# EAGLE schematic A9G Minimal Hardware (EAGLE 9.6.2)
AUTHOR: Tiago Silva; SOURCE: github.com/TiagoPaulaSilva/A9G-Arduino-Library; VERSION: 1.0
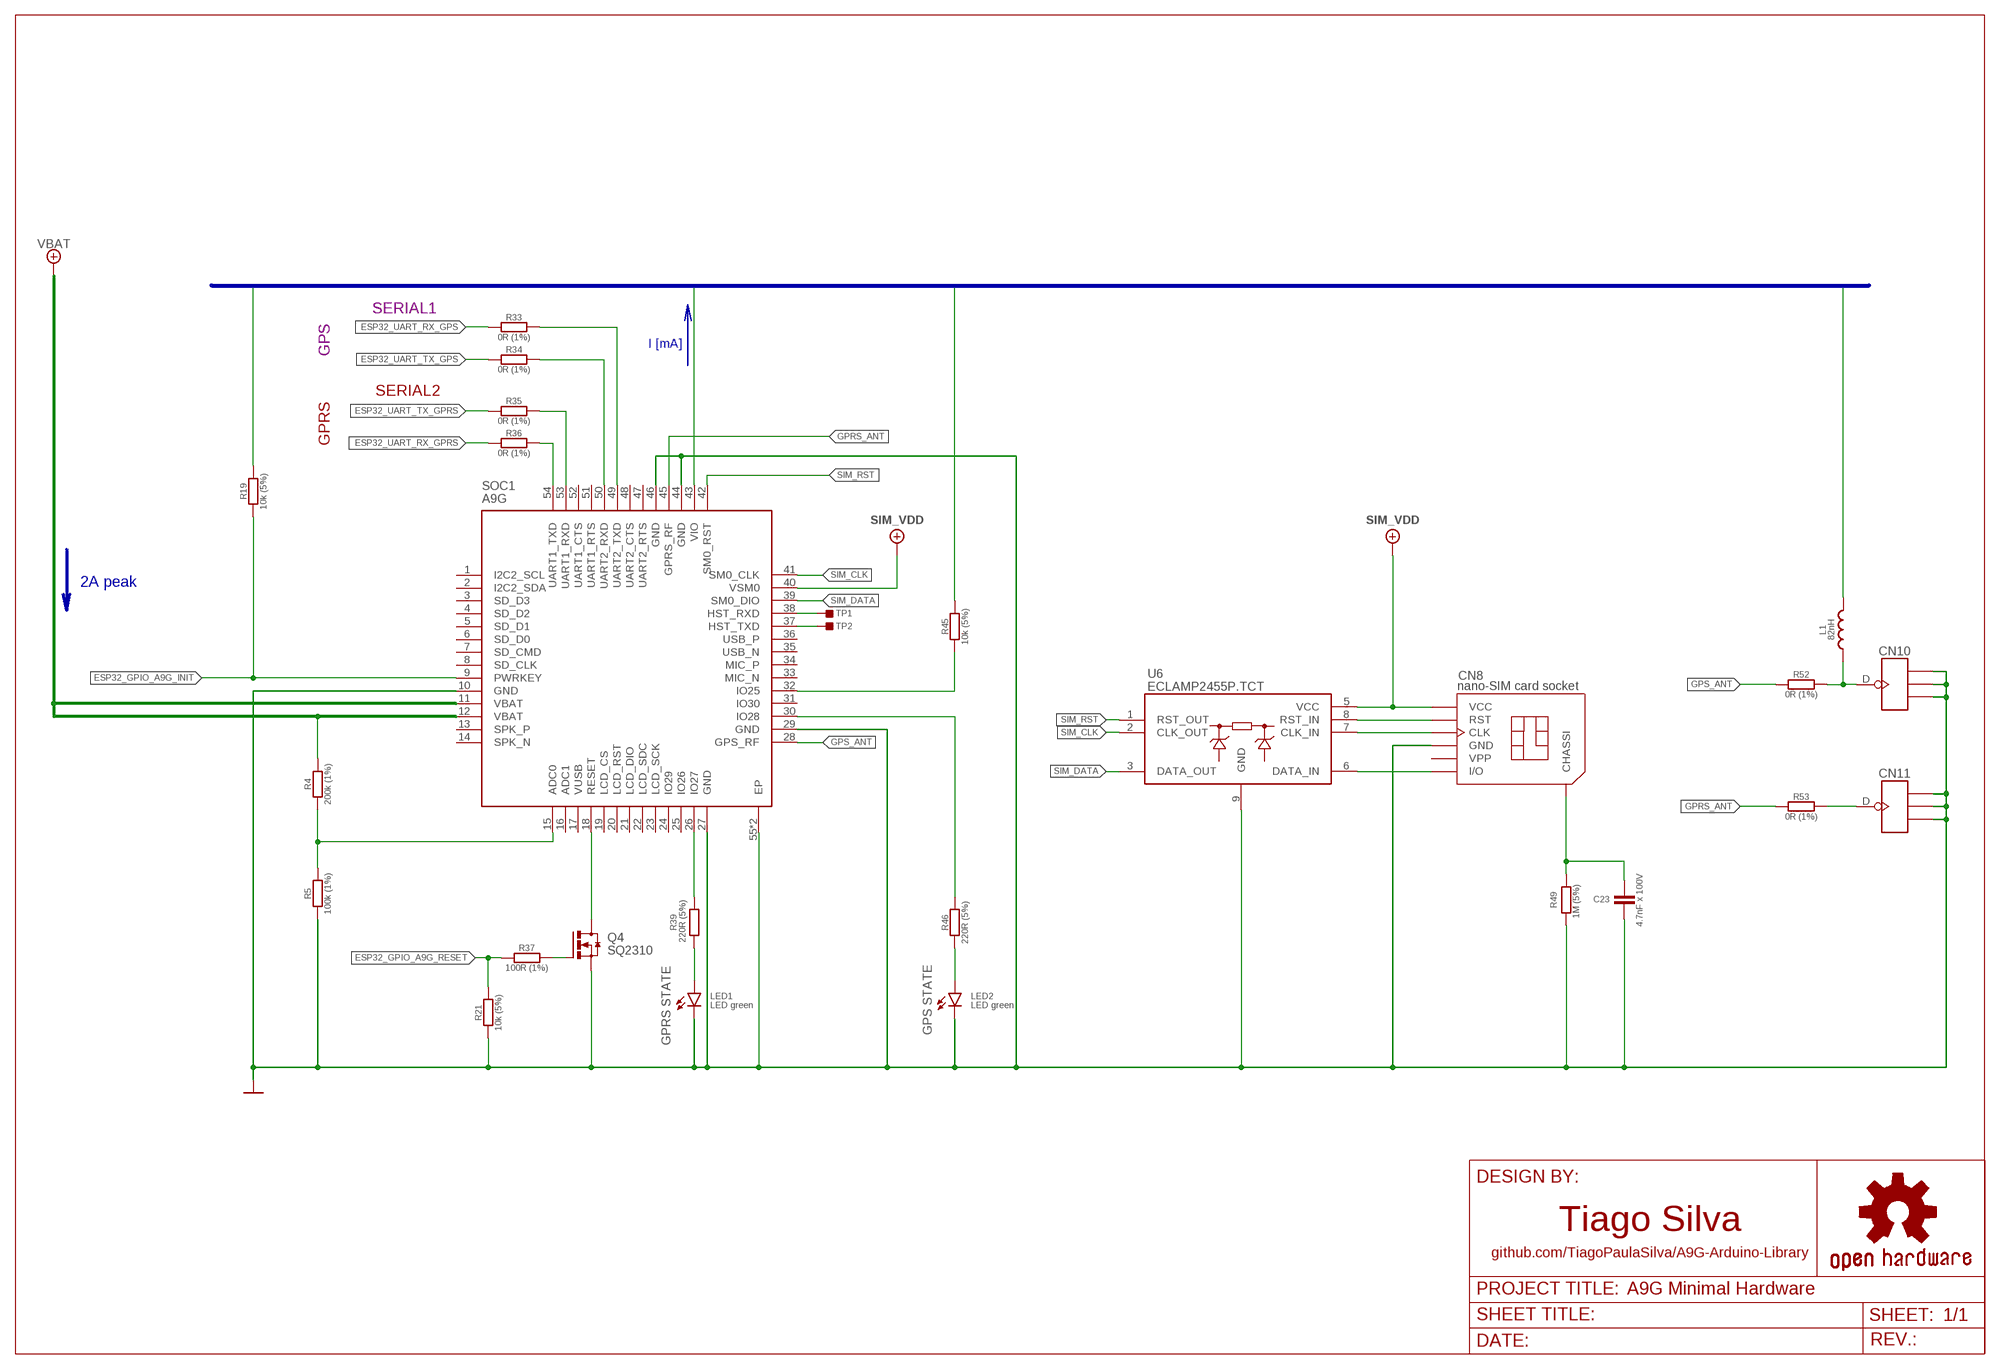
[diagram p0: schematic, sheet 1]

## Parts
C23  4.7nF x 100V  C_0402  [C0402]
CN8  nano-SIM card socket  SIM-CARD  [SIM-CARD]
CN10  ANTENNA-U-FL  [4P-U-FL]
CN11  ANTENNA-U-FL  [4P-U-FL]
L1  82nH  L_0402  [L0402]
LED1  LED green  LED-0603  [LED-0603]
LED2  LED green  LED-0603  [LED-0603]
Q4  N-Channel MOSFET  N-FET-ENHANCEMENT-SQ2310  [SOT23-3]
R4  200k (1%)  R_0402  [R0402]
R5  100k (1%)  R_0402  [R0402]
R19  10k (5%)  R_0402  [R0402]
R21  10k (5%)  R_0402  [R0402]
R33  0R (1%)  R_0402  [R0402]
R34  0R (1%)  R_0402  [R0402]
R35  0R (1%)  R_0402  [R0402]
R36  0R (1%)  R_0402  [R0402]
R37  100R (1%)  R_0402  [R0402]
R39  220R (5%)  R_0402  [R0402]
R45  10k (5%)  R_0402  [R0402]
R46  220R (5%)  R_0402  [R0402]
R49  1M (5%)  R_0402  [R0402]
R52  0R (1%)  R_0402  [R0402]
R53  0R (1%)  R_0402  [R0402]
SOC1  A9G  [A9G]
TP1  ATP2-30  [ATP-30]
TP2  ATP2-30  [ATP-30]
U6  ECLAMP2455P.TCT  [SLP2116P8]

## Nets
0V: C23.1 CN8.C5(GND) CN10.GND1 CN10.GND2 CN10.GND3 CN11.GND1 CN11.GND2 CN11.GND3 LED1.C(K) LED2.C(K) Q4.2(S) R5.1 R21.1 R49.2 SOC1.10(GND) SOC1.27(GND) SOC1.29(GND) SOC1.44(GND) SOC1.46(GND) SOC1.55(EP) SOC1.56(EP) U6.9(GND)
A9G_LOW_POWER: R45.1 SOC1.32(IO25)
ESP32_GPIO_A9G_INIT: R19.1 SOC1.9(PWRKEY)
ESP32_GPIO_A9G_RESET: R21.2 R37.1
ESP32_UART_RX_GPRS: R36.1
ESP32_UART_RX_GPS: R33.1
ESP32_UART_TX_GPRS: R35.1
ESP32_UART_TX_GPS: R34.1
GND_A9G_1: Q4.3(D) SOC1.18(RESET)
GPRS_ANT: R53.1 SOC1.45(GPRS_RF)
GPS_ANT: R52.1 SOC1.28(GPS_RF)
N$1: C23.2 CN8.P1(CHASSI) CN8.P2(CHASSI) CN8.P3(CHASSI) CN8.P4(CHASSI) CN8.P5(CHASSI) CN8.P6(CHASSI) R49.1
N$4: SOC1.38(HST_RXD) TP1.P
N$7: SOC1.37(HST_TXD) TP2.P
N$20: Q4.1(G) R37.2
N$24: LED1.A R39.1
N$25: LED2.A R46.1
N$26: R4.1 R5.2 SOC1.15(ADC0)
N$27: R36.2 SOC1.54(UART1_TXD)
N$29: R33.2 SOC1.49(UART2_TXD)
N$34: R39.2 SOC1.26(IO27)
N$36: R46.2 SOC1.30(IO28)
N$38: R35.2 SOC1.53(UART1_RXD)
N$40: R34.2 SOC1.50(UART2_RXD)
N$94: CN11.D R53.2
N$98: CN10.D L1.2 R52.2
N$100: CN8.C2(RST) U6.8(RST_IN)
N$101: CN8.C3(CLK) U6.7(CLK_IN)
N$102: CN8.C7(I/O) U6.6(DATA_IN)
SIM_CLK: SOC1.41(SM0_CLK) U6.2(CLK_OUT)
SIM_DATA: SOC1.39(SM0_DIO) U6.3(DATA_OUT)
SIM_RST: SOC1.42(SM0_RST) U6.1(RST_OUT)
SIM_VDD: CN8.C1(VCC) SOC1.40(VSM0) U6.5(VCC)
VBAT: R4.2 SOC1.11(VBAT) SOC1.12(VBAT)
VIO: L1.1 R19.2 R45.2 SOC1.43(VIO)
Unconnected: CN8.C6(VPP) SOC1.1(I2C2_SCL) SOC1.2(I2C2_SDA) SOC1.3(SD_D3) SOC1.4(SD_D2) SOC1.5(SD_D1) SOC1.6(SD_D0) SOC1.7(SD_CMD) SOC1.8(SD_CLK) SOC1.13(SPK_P) SOC1.14(SPK_N) SOC1.16(ADC1) SOC1.17(VUSB) SOC1.19(LCD_CS) SOC1.20(LCD_RST) SOC1.21(LCD_DIO) SOC1.22(LCD_SDC) SOC1.23(LCD_SCK) SOC1.24(IO29) SOC1.25(IO26) SOC1.31(IO30) SOC1.33(MIC_N) SOC1.34(MIC_P) SOC1.35(USB_N) SOC1.36(USB_P) SOC1.47(UART2_RTS) SOC1.48(UART2_CTS) SOC1.51(UART1_RTS) SOC1.52(UART1_CTS)

## Buses
VIO

## Notes on the sheet
- SERIAL1
- GPS | I [mA]
- SERIAL2
- GPRS
- 2A peak
- GPS STATE
- GPRS STATE

## Library data of the parts
C23 = My-RLC:C_: NON-POLARIZED CAP; PARTNO: GRM155R72A472KA01D
CN8 = My-Sockets:SIM-CARD: Nano SIM Card Connector; PARTNO: 693043020611; PN: 693043020611
CN10 CN11 = My-Antenna:ANTENNA-U-FL: U.FL Connector; PARTNO: U.FL-R-SMT-1(10); PN: U.FL-R-SMT-1(10)
L1 = My-RLC:L_: INDUCTOR; PARTNO: LQG15WH82NG02D; PN: LQG15WH82NG02D
LED1 LED2 = My-LEDs:LED: LED (Generic) Standard schematic elements and footprints for 5mm, 3mm, 1206, and 0603 sized LEDs. Generic LEDs with no color specified.; PARTNO: LTST-C191KGKT; PN: 150060VS75000
Q4 = My-Transistors:N-FET-ENHANCEMENT-; FAMILY: SQ2310; ID: 6A; PARTNO: SQ2310ES-T1_GE3; PD: 2W; PN: SQ2310ES-T1_GE3; RDS: 24 mOhms; VDS: 20V; VGS: ±8V
R4 = My-RLC:R_: RESISTOR; PN: RC0402FR-07200KL
R5 = My-RLC:R_: RESISTOR; PN: RC0402FR-07100KL
R19 R45 = My-RLC:R_: RESISTOR; PARTNO: RC0402FR-0710KL; PN: RC0402JR-0710KL
R21 = My-RLC:R_: RESISTOR; PN: RC0402JR-0710KL
R33-R36 = My-RLC:R_: RESISTOR; PN: RC0402FR-070RL
R37 = My-RLC:R_: RESISTOR; PARTNO: RC0402FR-07100RL; PN: RC0402FR-07100RL
R39 R46 = My-RLC:R_: RESISTOR
R49 = My-RLC:R_: RESISTOR; PARTNO: RC0402JR-071ML
R52 R53 = My-RLC:R_: RESISTOR; PARTNO: RC0402FR-070RL; PN: RC0402FR-070RL
SOC1 = My-SoCs:A9G: Ai-Thinker A9G Module - Quad-band GSM, GPRS and GPS: 850/900/1800/1900MHz; PARTNO: A9G
TP1 TP2 = My-TestPoints:ATP2: AUTOMATED TEST POINT for automated bed of nails machinery; BOM: EXCLUDE
U6 = My-Diodes:ECLAMP2455P.TCT: ESD/EMI Protection for SIM Card Source: Datasheet <https://componentsearchengine.com/Datasheets/1/ECLAMP2455P.TCT.pdf>; DESCRIPTION: ESD Suppressors / TVS Diodes ESD/EMI PROT FOR COLOR LCD INT; HEIGHT: 0.65mm; MANUFACTURER_NAME: SEMTECH; MANUFACTURER_PART_NUMBER: ECLAMP2455P.TCT; MOUSER_PART_NUMBER: 947-ECLAMP2455P.TCT; MOUSER_PRICE-STOCK: https://www.mouser.co.uk/ProductDetail/Semtech/ECLAMP2455PTCT?qs=rBWM4%252BvDhIfn3YV9USj7Lg%3D%3D; PARTNO: ECLAMP2455P.TCT; PN: ECLAMP2455P.TCT